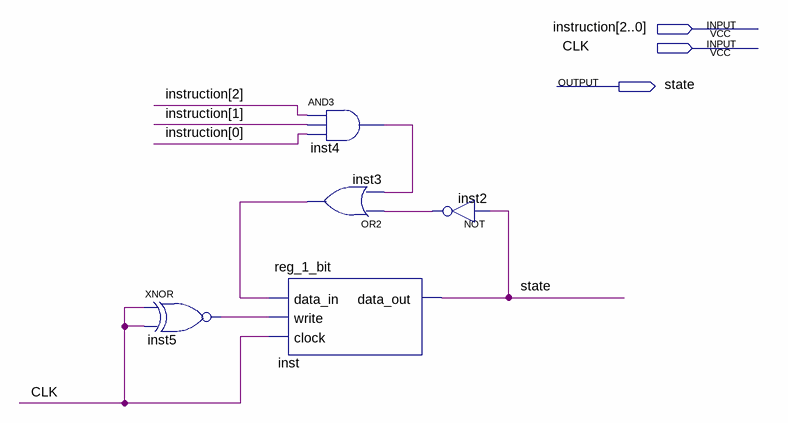
[diagram p0: schematic sheet]
// Quartus schematic controler_state_looper.bdf as structural Verilog: 5 symbols, 3 pins
module controler_state_looper (
  input  [2:0] instruction,
  input  CLK,
  output state
);

  wire inst2_out, inst3_out, inst4_out, inst5_out;

  xnor inst5 (inst5_out, CLK, CLK);
  reg_1_bit inst (.data_in(inst3_out), .write(inst5_out), .clock(CLK), .data_out(state));
  and inst4 (inst4_out, instruction[2], instruction[1], instruction[0]);
  or inst3 (inst3_out, inst2_out, inst4_out);
  not inst2 (inst2_out, state);
endmodule
